# EAGLE design electricals_with_iPod_v2.5 (EAGLE 6.5.0)
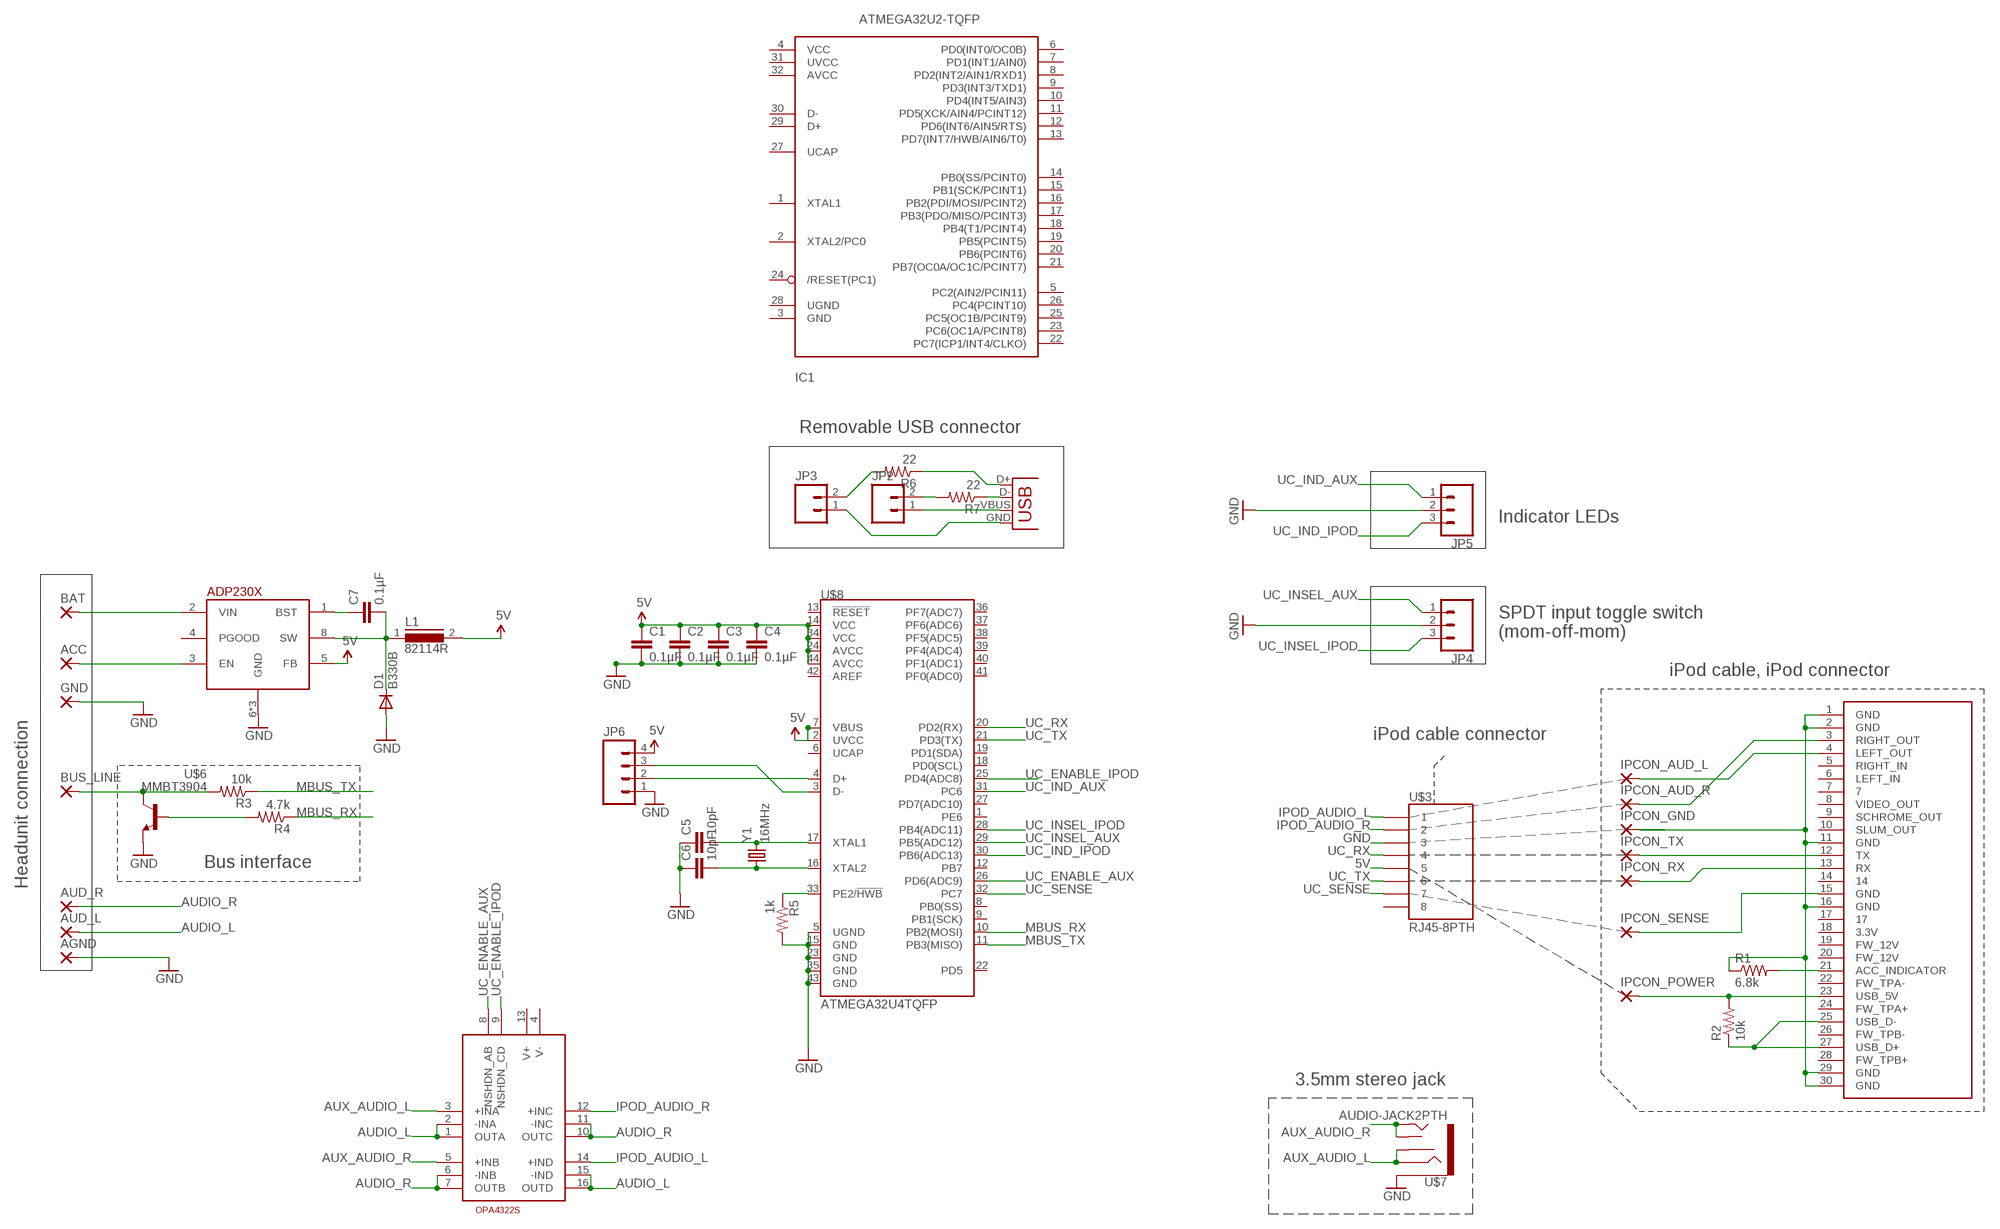
[diagram p0: schematic, sheet 1]

## Parts
ACC  1,6/0,9  [1,6/0,9]
AGND  1,6/0,9  [1,6/0,9]
AUD_L  1,6/0,9  [1,6/0,9]
AUD_R  1,6/0,9  [1,6/0,9]
BAT  2,54/1,1  [2,54/1,1]
BUS_LINE  1,6/0,9  [1,6/0,9]
C1  0.1µF  CAP0805  [0805]
C2  0.1µF  CAP0805  [0805]
C3  0.1µF  CAP0805  [0805]
C4  0.1µF  CAP0805  [0805]
C5  10pF  CAP0805  [0805]
C6  10pF  CAP0805  [0805]
C7  0.1µF  CAP0805  [0805]
D1  B330B  DIODESMA-ALT  [SMA-DIODE_ALT]
GND  2,54/1,1  [2,54/1,1]
IC1  ATMEGA32U2-TQFP  [TQFP32-08]
IPCON_AUD_L  1,6/0,9  [1,6/0,9]
IPCON_AUD_R  1,6/0,9  [1,6/0,9]
IPCON_GND  1,6/0,9  [1,6/0,9]
IPCON_POWER  1,6/0,9  [1,6/0,9]
IPCON_RX  1,6/0,9  [1,6/0,9]
IPCON_SENSE  1,6/0,9  [1,6/0,9]
IPCON_TX  1,6/0,9  [1,6/0,9]
JP1  USBSMD  [USB-MINIB]
JP2  M02POGO_PIN_HOLES_ONLY  [1X02_PP_HOLES_ONLY]
JP3  M02POGO_PIN_HOLES_ONLY  [1X02_PP_HOLES_ONLY]
JP4  M03LOCK  [1X03_LOCK]
JP5  M03LOCK  [1X03_LOCK]
JP6  M04PTH  [1X04]
L1  82114R  [82114R]
R1  6.8k  RESISTOR0805-RES  [0805]
R2  10k  RESISTOR0805-RES  [0805]
R3  10k  RESISTOR0805-RES  [0805]
R4  4.7k  RESISTOR0805-RES  [0805]
R5  1k  RESISTOR0805-RES  [0805]
R6  22  RESISTOR0805-RES  [0805]
R7  22  RESISTOR0805-RES  [0805]
U$1  IPOD_CONNECTOR_MALE  [IPOD_MALE_CONNECTOR]
U$3  RJ45-8PTH  [RJ45-8]
U$5  ADP230X  [SO8-THERM]
U$6  MMBT3904  [SOT23-3]
U$7  AUDIO-JACK2PTH  [AUDIO-JACK]
U$8  ATMEGA32U4TQFP  [SPARKFUN-DIGITALIC_TQFP44]
U$11  OPA4322S  [TSSOP16]
Y1  16MHz  CRYSTAL5X3  [CRYSTAL-SMD-5X3]

## Nets
5V: C1.1 C2.1 C3.1 C4.1 JP6.4 L1.2 U$3.5 U$5.5(FB) U$8.2(UVCC) U$8.7(VBUS) U$8.14(VCC) U$8.24(AVCC) U$8.34(VCC) U$8.44(AVCC)
AUDIO_L: AUD_L.1(P) U$11.1(OUTA) U$11.2(-INA) U$11.15(-IND) U$11.16(OUTD)
AUDIO_R: AUD_R.1(P) U$11.6(-INB) U$11.7(OUTB) U$11.10(OUTC) U$11.11(-INC)
AUX_AUDIO_L: U$7.RING U$7.RSH U$11.3(+INA)
AUX_AUDIO_R: U$7.TIP U$7.TSH U$11.5(+INB)
GND: AGND.1(P) C1.2 C2.2 C3.2 C4.2 C5.1 C6.1 D1.A GND.1(P) JP4.2 JP5.2 JP6.1 R5.2 U$3.3 U$5.6(GND) U$5.7(GND) U$5.PAD(GND) U$6.2(E) U$7.SLEEVE U$8.5(UGND) U$8.15(GND) U$8.23(GND) U$8.35(GND) U$8.43(GND)
IP_GND: IPCON_GND.1(P) R1.1 U$1.1(GND) U$1.2(GND) U$1.11(GND) U$1.16(GND) U$1.29(GND) U$1.30(GND)
IPOD_AUDIO_L: U$3.1 U$11.14(+IND)
IPOD_AUDIO_R: U$3.2 U$11.12(+INC)
MBUS_RX: R4.1 U$8.10(PB2(MOSI))
MBUS_TX: R3.1 U$8.11(PB3(MISO))
N$1: ACC.1(P) U$5.3(EN)
N$2: BAT.1(P) U$5.2(VIN)
N$3: C7.2 D1.C L1.1 U$5.8(SW)
N$4: IPCON_POWER.1(P) R2.2 U$1.23(USB_5V)
N$5: C7.1 U$5.1(BST)
N$6: IPCON_SENSE.1(P) U$1.15(GND)
N$7: IPCON_RX.1(P) U$1.13(RX)
N$8: IPCON_TX.1(P) U$1.12(TX)
N$9: IPCON_AUD_R.1(P) U$1.3(RIGHT_OUT)
N$10: IPCON_AUD_L.1(P) U$1.4(LEFT_OUT)
N$11: R2.1 U$1.25(USB_D-) U$1.27(USB_D+)
N$13: R1.2 U$1.21(ACC_INDICATOR)
N$14: R5.1 U$8.33(PE2/!HWB)
N$15: C5.2 U$8.17(XTAL1) Y1.3
N$19: BUS_LINE.1(P) R3.2 U$6.3(C)
N$20: R4.2 U$6.1(B)
N$21: JP1.D+ R6.1
N$22: JP1.D- R7.1
N$28: C6.2 U$8.16(XTAL2) Y1.1
UC_ENABLE_AUX: U$8.26(PD6(ADC9)) U$11.8(NSHDN_AB)
UC_ENABLE_IPOD: U$8.25(PD4(ADC8)) U$11.9(NSHDN_CD)
UC_IND_AUX: JP5.1 U$8.31(PC6)
UC_IND_IPOD: JP5.3 U$8.30(PB6(ADC13))
UC_INSEL_AUX: JP4.1 U$8.29(PB5(ADC12))
UC_INSEL_IPOD: JP4.3 U$8.28(PB4(ADC11))
UC_RX: U$3.4 U$8.20(PD2(RX))
UC_SENSE: U$3.7 U$8.32(PC7)
UC_TX: U$3.6 U$8.21(PD3(TX))
USB_BOB_D+: JP3.2 R6.2
USB_BOB_D-: JP2.2 R7.2
USB_BOB_GND: JP1.GND JP3.1
USB_BOB_VBUS: JP1.VBUS JP2.1
USB_D+: JP6.2 U$8.4(D+)
USB_D-: JP6.3 U$8.3(D-)
Unconnected: IC1.1(XTAL1) IC1.2(XTAL2/PC0) IC1.3(GND) IC1.4(VCC) IC1.5(PC2(AIN2/PCIN11)) IC1.6(PD0(INT0/OC0B)) IC1.7(PD1(INT1/AIN0)) IC1.8(PD2(INT2/AIN1/RXD1)) IC1.9(PD3(INT3/TXD1)) IC1.10(PD4(INT5/AIN3)) IC1.11(PD5(XCK/AIN4/PCINT12)) IC1.12(PD6(INT6/AIN5/RTS)) IC1.13(PD7(INT7/HWB/AIN6/T0)) IC1.14(PB0(SS/PCINT0)) IC1.15(PB1(SCK/PCINT1)) IC1.16(PB2(PDI/MOSI/PCINT2)) IC1.17(PB3(PDO/MISO/PCINT3)) IC1.18(PB4(T1/PCINT4)) IC1.19(PB5(PCINT5)) IC1.20(PB6(PCINT6)) IC1.21(PB7(OC0A/OC1C/PCINT7)) IC1.22(PC7(ICP1/INT4/CLKO)) IC1.23(PC6(OC1A/PCINT8)) IC1.24(/RESET(PC1)) IC1.25(PC5(OC1B/PCINT9)) IC1.26(PC4(PCINT10)) IC1.27(UCAP) IC1.28(UGND) IC1.29(D+) IC1.30(D-) IC1.31(UVCC) IC1.32(AVCC) U$1.5(RIGHT_IN) U$1.6(LEFT_IN) U$1.7 U$1.8(VIDEO_OUT) U$1.9(SCHROME_OUT) U$1.10(SLUM_OUT) U$1.14 U$1.17 U$1.18(3.3V) U$1.19(FW_12V) U$1.20(FW_12V) U$1.22(FW_TPA-) U$1.24(FW_TPA+) U$1.26(FW_TPB-) U$1.28(FW_TPB+) U$3.8 U$5.4(PGOOD) U$8.1(PE6) U$8.6(UCAP) U$8.8(PB0(SS)) U$8.9(PB1(SCK)) U$8.12(PB7) U$8.13(!RESET) U$8.18(PD0(SCL)) U$8.19(PD1(SDA)) U$8.22(PD5) U$8.27(PD7(ADC10)) U$8.36(PF7(ADC7)) U$8.37(PF6(ADC6)) U$8.38(PF5(ADC5)) U$8.39(PF4(ADC4)) U$8.40(PF1(ADC1)) U$8.41(PF0(ADC0)) U$8.42(AREF) U$11.4(V-) U$11.13(V+)

## Notes on the sheet
- Removable USB connector
- Indicator LEDs
- SPDT input toggle switch
  (mom-off-mom)
- iPod cable, iPod connector
- iPod cable connector
- Headunit connection
- Bus interface
- 3.5mm stereo jack

## Library data of the parts
ACC AGND AUD_L AUD_R BUS_LINE IPCON_AUD_L IPCON_AUD_R IPCON_GND IPCON_POWER IPCON_RX IPCON_SENSE IPCON_TX = wirepad:1,6/0,9: THROUGH-HOLE PAD
BAT GND = wirepad:2,54/1,1: THROUGH-HOLE PAD
C1-C7 = SparkFun-Passives:CAP: Capacitor Standard 0603 ceramic capacitor, and 0.1" leaded capacitor.
D1 = SparkFun:DIODE: Diode These are standard reverse protection diodes and small signal diodes. SMA package can handle up to about 1A. SOD-323 can handle about 200mA. What the SOD-323 package when ordering, there are some mfgs out there that are 5-pin packages.
IC1 = adafruit:ATMEGA32U2: ATmega32u2 Pin compatible with the atmega8u2, atmega16u2 and atmega32u2 8, 16 or 32 K flash, 1K RAM, 512b EEPROM 8 bit and 16 bit timer (5 PWM total) UART, SPI (no I2C!) USB with 4 endpoints, LUFA compatible 22 I/O lines, analog comparator (no ADC!) Comes with DFU bootloader burned in!
JP1 = SparkFun-Connectors:USB: USB Connectors USB-B-PTH is fully proven SKU : PRT-00139/CONN-08278 USB-miniB is fully proven SKU : PRT-00587 USB-A-PCB is untested. USB-A-H is throughly reviewed, but untested. Spark Fun Electronics SKU : PRT-00437 USB-B-SMT is throughly reviewed, but untested. Needs silkscreen touching up. USB-A-S has not been used/tested USB-MB-H has not been used/tested USB-MICROB has been used. CONN-09505
JP2 JP3 = SparkFun-Connectors:M02: Header 2 Standard 2-pin 0.1" header. Use with straight break away headers (SKU : PRT-00116), right angle break away headers (PRT-00553), swiss pins (PRT-00743), machine pins (PRT-00117), and female headers (PRT-00115). Molex polarized connector foot print use with SKU : PRT-08233 with associated crimp pins and housings.
JP4 JP5 = SparkFun-Connectors:M03: Header 3 Standard 3-pin 0.1" header. Use with straight break away headers (SKU : PRT-00116), right angle break away headers (PRT-00553), swiss pins (PRT-00743), machine pins (PRT-00117), and female headers (PRT-00115). Molex polarized connector foot print use with SKU : PRT-08232 with associated crimp pins and housings.
JP6 = SparkFun-Connectors:M04: Header 4 Standard 4-pin 0.1" header. Use with straight break away headers (SKU : PRT-00116), right angle break away headers (PRT-00553), swiss pins (PRT-00743), machine pins (PRT-00117), and female headers (PRT-00115). Molex polarized connector foot print use with SKU : PRT-08231 with associated crimp pins and housings. 1MM SMD Version SKU: PRT-10208
L1 = inductors:82114R: INDUCTOR
R1-R7 = SparkFun-Resistors:RESISTOR: Resistor Basic schematic elements and footprints for 0603, 1206, and PTH resistors.
U$1 = SparkFun:IPOD_CONNECTOR_MALE: iPod Male Connector This is the connector that will insert into an iPods. Use this connector to gain access to the various iPod pins. Schematic and footprint are not yet production proven. The PCB thickness must be more thin than the standard 0.062" FR4. Spark Fun Electronics SKU : DEV-00633
U$3 = SparkFun-Connectors:RJ45-8: RJ45 Jack Simple RJ45, 8-pin connection - connector for common Cat5, Cat5e, and Cat6 Ethernet cables. Footprint not yet proven in production. Connector sku is PRT-00643; Breakout PCB sku is BOB-00716.
U$5 = personal:ADP230X
U$6 = personal:MMBT3904
U$7 = SparkFun-Connectors:AUDIO-JACK2: Stereo audio jack with bypass switches.
U$8 = SparkFun-DigitalIC:ATMEGA32U4: Atmel 44-pin 8-bit Microcontroller with 32KBytes of ISP Flash and USB Controller
U$11 = personal:OPA4322S
Y1 = SparkFun-FreqCtrl:CRYSTAL: Various standard crystals. Proven footprints. Spark Fun Electronics SKU : COM-00534

## Board
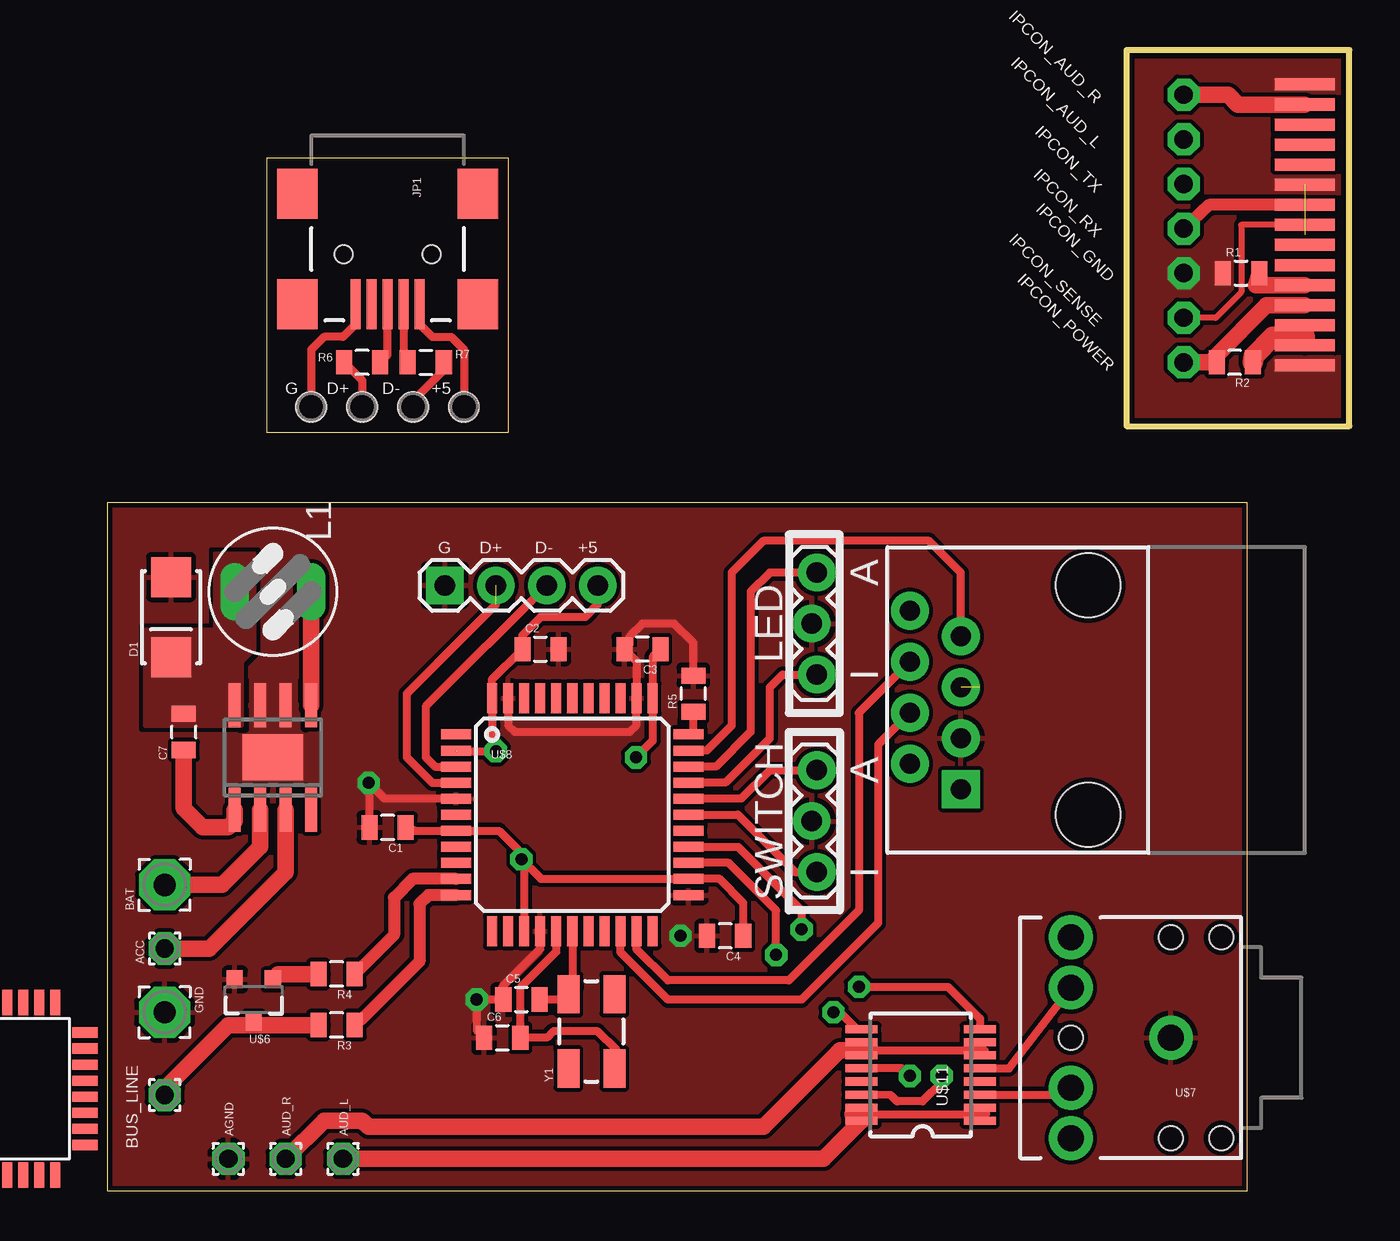
[diagram p1: board, top side]
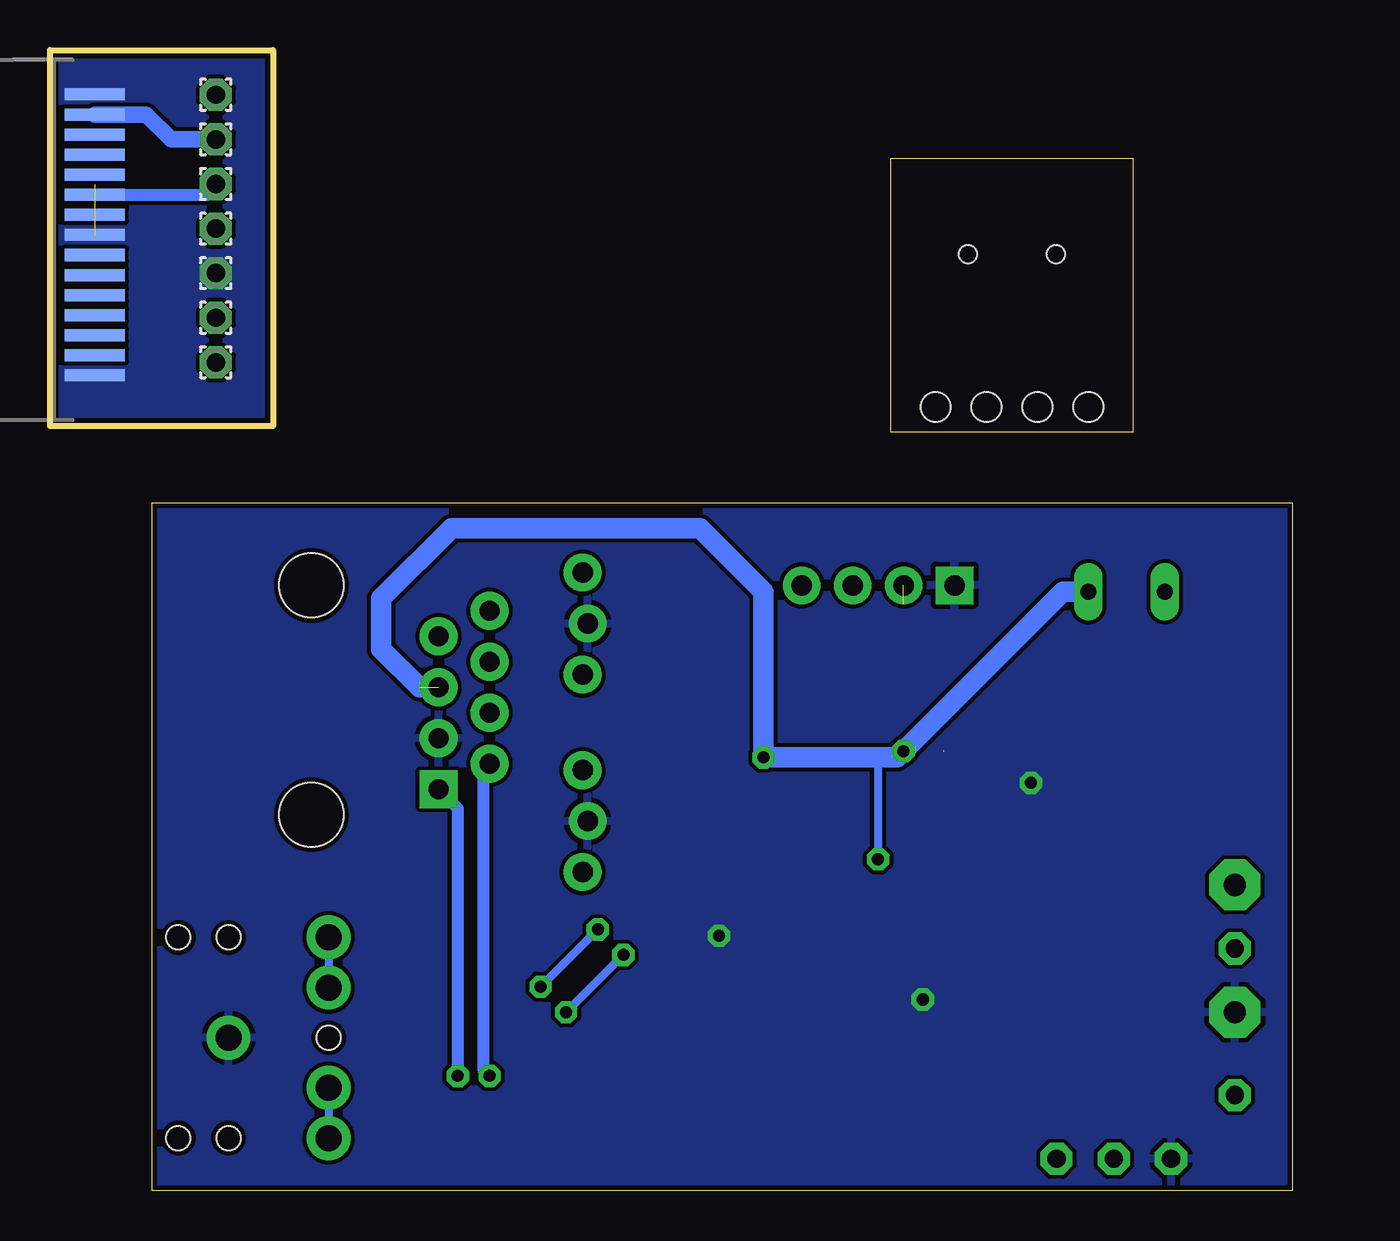
[diagram p2: board, bottom side, seen from below]

Size 61.91 x 56.83 mm. Coordinates in mm from the lower left corner, seen from the top.
Outline: 0,0 56.82,0 56.82,34.28 0,34.28 0,0
Outline: 61.91,56.83 50.8,56.83 50.8,38.1 61.91,38.1 61.91,56.83
Outline: 7.94,51.44 7.94,37.78 20,37.78 20,51.44 7.94,51.44
Copper layers (1*16): Top 0.035mm / dielectric 1.5mm / Bottom 0.035mm
Design rules "SparkFun": minimum track width 8mil, minimum drill 20mil, track to track 8mil, track to pad 8mil, pad to pad 8mil, via to via 8mil, smd to smd 8mil, copper to edge 10mil, drill to drill 8mil, minimum pad ring 12mil, minimum via ring 10mil, stop-mask expansion 4mil, vias tented up to drill 25mil, thermal gap 10mil

### Footprints (pad centres in the part's own frame; a part is rotated, then mirrored left to right if it is on the bottom)
1,6/0,9 = drill 0.914 pad 1.6 octagon: 1 0,0
2,54/1,1 = drill 1.118 pad 2.54 octagon: 1 0,0
0805 = smd 0.8 x 1.2: 1 -0.9,0; 2 0.9,0
SMA-DIODE_ALT = smd 2 x 2: A -2,0; C 2,0
TQFP32-08 = smd 1.27 x 0.508: 1 -4.293,2.8; 2 -4.293,2; 3 -4.293,1.2; 4 -4.293,0.4; 5 -4.293,-0.4; 6 -4.293,-1.2; 7 -4.293,-2; 8 -4.293,-2.8; 17 4.293,-2.8; 18 4.293,-2; 19 4.293,-1.2; 20 4.293,-0.4; 21 4.293,0.4; 22 4.293,1.2; 23 4.293,2; 24 4.293,2.8 | smd 0.508 x 1.27: 9 -2.8,-4.293; 10 -2,-4.293; 11 -1.2,-4.293; 12 -0.4,-4.293; 13 0.4,-4.293; 14 1.2,-4.293; 15 2,-4.293; 16 2.8,-4.293; 25 2.8,4.293; 26 2,4.293; 27 1.2,4.293; 28 0.4,4.293; 29 -0.4,4.293; 30 -1.2,4.293; 31 -2,4.293; 32 -2.8,4.293
USB-MINIB = smd 2.5 x 0.5: D+ 2.5,0; D- 2.5,0.8; GND 2.5,-1.6; ID 2.5,-0.8; VBUS 2.5,1.6 | smd 2.5 x 2: MTN1 -3,4.5; MTN2 2.5,4.5; MTN3 -3,-4.5; MTN4 2.5,-4.5 | hole 0.9: 0,2.2; 0,-2.2
1X02_PP_HOLES_ONLY = drill 0.889 pad 0.813: 1 0,0; 2 2.54,0 | hole 1.473: 0,0; 2.54,0
1X03_LOCK = drill 1.016 pad 1.88: 1 0,0.127; 2 2.54,-0.127; 3 5.08,0.127
1X04 = drill 1.016 pad 1.88 square: 1 0,0 | drill 1.016 pad 1.88: 2 2.54,0; 3 5.08,0; 4 7.62,0
82114R = drill 0.813 long: 1 0,1.905; 2 0,-1.905
IPOD_MALE_CONNECTOR = smd 0.6 x 3 bottom: 1 7.5,0; 3 6.5,0; 5 5.5,0; 7 4.5,0; 9 3.5,0; 11 2.5,0; 13 1.5,0; 15 0.5,0; 17 -0.5,0; 19 -1.5,0; 21 -2.5,0; 23 -3.5,0; 25 -4.5,0; 27 -5.5,0; 29 -6.5,0 | smd 0.6 x 3: 2 7,0; 4 6,0; 6 5,0; 8 4,0; 10 3,0; 12 2,0; 14 1,0; 16 0,0; 18 -1,0; 20 -2,0; 22 -3,0; 24 -4,0; 26 -5,0; 28 -6,0; 30 -7,0
RJ45-8 = drill 1 pad 1.88 square: 1 -4.445,6.35 | drill 1 pad 1.88: 2 -3.175,8.89; 3 -1.905,6.35; 4 -0.635,8.89; 5 0.635,6.35; 6 1.905,8.89; 7 3.175,6.35; 8 4.445,8.89 | hole 3.2: -5.715,0; 5.715,0
SO8-THERM = smd 0.6 x 2.2: 1 -1.905,-2.6; 2 -0.635,-2.6; 3 0.635,-2.6; 4 1.905,-2.6; 5 1.905,2.6; 6 0.635,2.6; 7 -0.635,2.6; 8 -1.905,2.6 | smd 3 x 2.3: PAD 0,0
SOT23-3 = smd 0.8 x 0.9: 1 -0.95,-1; 2 0.95,-1; 3 0,1.1
AUDIO-JACK = drill 1.3 pad 2.184: RING 5,5; RSH 5,2.5; SLEEVE 0,0; TIP 5,-5; TSH 5,-2.5 | hole 1.2: 0,5; -2.5,5; -2.5,-5; 0,-5; 5,0
SPARKFUN-DIGITALIC_TQFP44 = smd 1.5 x 0.5: 1 -5.8,4; 2 -5.8,3.2; 3 -5.8,2.4; 4 -5.8,1.6; 5 -5.8,0.8; 6 -5.8,0; 7 -5.8,-0.8; 8 -5.8,-1.6; 9 -5.8,-2.4; 10 -5.8,-3.2; 11 -5.8,-4; 23 5.8,-4; 24 5.8,-3.2; 25 5.8,-2.4; 26 5.8,-1.6; 27 5.8,-0.8; 28 5.8,0; 29 5.8,0.8; 30 5.8,1.6; 31 5.8,2.4; 32 5.8,3.2; 33 5.8,4 | smd 0.5 x 1.5: 12 -4,-5.8; 13 -3.2,-5.8; 14 -2.4,-5.8; 15 -1.6,-5.8; 16 -0.8,-5.8; 17 0,-5.8; 18 0.8,-5.8; 19 1.6,-5.8; 20 2.4,-5.8; 21 3.2,-5.8; 22 4,-5.8; 34 4,5.8; 35 3.2,5.8; 36 2.4,5.8; 37 1.6,5.8; 38 0.8,5.8; 39 0,5.8; 40 -0.8,5.8; 41 -1.6,5.8; 42 -2.4,5.8; 43 -3.2,5.8; 44 -4,5.8
TSSOP16 = smd 0.4 x 1.6: 1 -2.225,-2.85; 2 -1.575,-2.85; 3 -0.925,-2.85; 4 -0.275,-2.85; 5 0.375,-2.85; 6 1.025,-2.85; 7 1.675,-2.85; 8 2.325,-2.85; 9 2.325,3.05; 10 1.675,3.05; 11 1.025,3.05; 12 0.375,3.05; 13 -0.275,3.05; 14 -0.925,3.05; 15 -1.575,3.05; 16 -2.225,3.05
CRYSTAL-SMD-5X3 = smd 1.9 x 1.1: 1 -1.85,-1.15; 2 1.85,-1.15; 3 1.85,1.15; 4 -1.85,1.15

### Placement (x,y rotation side)
ACC  2.86,12.06 90 top
AGND  6.03,1.59 180 top
AUD_L  11.75,1.59 180 top
AUD_R  8.89,1.59 180 top
BAT  2.86,15.24 90 top
BUS_LINE  2.86,4.76 90 top
C1  13.97,18.1 180 top
C2  21.59,26.99 0 top
C3  26.67,26.99 180 top
C4  30.8,12.7 180 top
C5  20.64,9.53 0 top
C6  19.68,7.62 0 top
C7  3.81,22.86 90 top
D1  3.17,28.57 270 top
GND  2.86,8.89 270 top
IC1  -5.4,5.08 0 top
IPCON_AUD_L  53.66,52.39 0 bottom
IPCON_AUD_R  53.66,54.61 0 bottom
IPCON_GND  53.66,45.72 0 bottom
IPCON_POWER  53.66,41.27 0 bottom
IPCON_RX  53.66,47.94 0 bottom
IPCON_SENSE  53.66,43.5 0 bottom
IPCON_TX  53.66,50.16 0 bottom
JP1  13.97,46.67 270 top
JP2  17.78,39.05 180 top
JP3  10.16,39.05 0 top
JP4  35.24,20.95 270 top
JP5  35.24,30.8 270 top
JP6  16.83,30.16 0 top
L1  8.26,29.84 90 top
R1  56.52,45.72 0 top
R2  56.2,41.27 180 top
R3  11.43,8.26 180 top
R4  11.43,10.79 180 top
R5  29.21,24.77 90 top
R6  12.7,41.27 180 top
R7  15.88,41.27 0 top
U$1  59.69,47.62 90 bottom
U$3  48.9,24.45 90 top
U$5  8.26,21.59 0 top
U$6  7.3,9.53 180 top
U$7  53.02,7.62 180 top
U$8  23.18,18.73 0 top
U$11  40.64,5.71 90 top
Y1  24.13,7.94 90 top

### Tracks (layer width: path | path; a pad name or v marks a point on that pad's centre or on a via)
5V  (via drill 0.6)  (2 unrouted)
  Top 0.406: 17.38,21.91 v19.37,21.91 19.18,22.73 U$8.44 19.18,25.48 C2.1 20.69,27.68 21.59,28.57 23.81,28.57 24.45,29.21 JP6.4 | v26.35,21.59 27.18,22.41 U$8.34 27.18,26.59 C3.1 | v20.64,16.51 20.78,16.37 U$8.14 | v20.64,16.51 21.61,15.53 U$8.24 29,15.51 29.06,15.56 30.48,15.56 31.7,14.34 C4.1 | v20.64,16.51 20.64,16.82 19.52,17.93 U$8.7 15.34,17.93 C1.1
  Top 0.813: U$5.5 L1.2
  Bottom 0.406: v26.35,21.59 20.64,21.59 | 20.64,21.59 v20.64,16.51 | 20.64,21.59 19.68,21.59 v19.37,21.91
  Bottom 1.016: 43.5,25.08 45.4,26.99 45.4,29.53 41.91,33.02 29.53,33.02 26.35,29.84 v26.35,21.59 19.68,21.59 11.43,29.84 L1.2
AUDIO_L
  Top 0.305: U$11.16 37.46,3.49 | U$11.1 43.8,3.81 43.49,3.82 U$11.2 | 37.15,3.81 37.28,3.81 U$11.15
  Top 0.406: 37.28,3.81 43.8,3.81
  Top 0.813: AUD_L.1 35.69,1.59 U$11.16 | 37.46,3.49 37.15,3.81
AUDIO_R
  Top 0.305: 37.59,7.18 U$11.11 37.59,6.86 37.47,6.99 37.59,7.18 | U$11.6 U$11.7 43.72,6.99 | U$11.10 37.59,7.18
  Top 0.406: 37.47,6.99 43.72,6.99
  Top 0.813: 37.47,6.99 36.51,6.99 32.7,3.17 13.02,3.17 12.7,3.49 10.79,3.49 AUD_R.1
AUX_AUDIO_L
  Top 0.406: U$11.3 47.08,4.79 U$7.RSH
  Bottom 0.406: U$7.RSH U$7.RING
AUX_AUDIO_R
  Top 0.406: U$11.5 44.95,6.09 U$7.TSH
  Bottom 0.406: U$7.TIP U$7.TSH
GND  (via drill 0.6)
  Top 0.406: U$8.5 13.82,19.53 v13.02,20.32 13.07,20.05 C1.2 | U$8.15 21.58,12.05 19.68,10.16 19.67,9.33 C5.1 v18.41,9.53 18.41,7.99 C6.1 | R5.2 29.21,27.3 28.26,28.26 26.67,28.26 26.04,27.62 26.04,27.25 C3.2 26.38,26.38 U$8.35 26.38,23.2 26.04,22.86 20.32,22.86 19.98,23.2 U$8.43
  other vias: 28.57,12.7
  pour Bottom: 0,34.29 56.83,34.29 56.83,0 0,0
  pour Top (rank 2): 0,34.29 0,0 56.83,0 56.83,34.29
  pour Top (isolate 0.254, rank 2, no thermals): 5.08,18.73 11.75,18.73 11.75,27.3 5.08,27.3
IP_GND  (1 unrouted)
  pour Top (no thermals): 50.8,56.83 50.8,38.1 61.91,38.1 61.91,56.83
  pour Bottom (no thermals): 50.8,56.83 50.8,38.1 61.91,38.1 61.91,56.83
IPOD_AUDIO_L  (via drill 0.6)
  Top 0.406: v41.59,5.71 41.59,5.4 40.64,4.45 39.37,4.45 39.05,4.76 U$11.14
  Bottom 0.61: U$3.1 41.59,19.05 v41.59,5.71
IPOD_AUDIO_R  (via drill 0.6)
  Top 0.406: v40.01,5.71 39.63,6.09 U$11.12
  Bottom 0.61: U$3.2 40.01,20.95 40.32,20.64 40.32,6.03 v40.01,5.71
MBUS_RX
  Top 0.61: U$8.10 15.21,15.53 14.29,14.61 14.29,12.75 R4.1
MBUS_TX
  Top 0.61: U$8.11 16,14.73 15.56,14.29 15.56,11.43 12.7,8.57 R3.1
N$1
  Top 0.813: ACC.1 5.08,12.06 8.89,15.88 U$5.3
N$2
  Top 0.813: BAT.1 5.71,15.24 7.62,17.14 U$5.2
N$3
  pour Top (isolate 0.254, no thermals): 1.91,27.94 5.4,27.94 5.4,31.75 7.3,31.75 7.3,26.99 6.67,26.35 6.67,23.18 1.91,23.18
N$4
  Top 0.61: 55.24,41.41 R2.2
  Top 0.813: U$1.23 57.78,44.12 55.24,41.59 55.24,41.41 | IPCON_POWER.1 R2.2
N$5
  Top 0.813: U$5.1 6.35,18.41 6.03,18.1 4.76,18.1 3.81,19.05 C7.1
N$6
  Top 0.305: U$1.15 56.52,48.12 56.52,44.77 55.24,43.5 IPCON_SENSE.1
N$7
  Top 0.61: U$1.13 54.93,49.12 IPCON_RX.1
N$8
  Bottom 0.61: U$1.12 54.07,49.62 IPCON_TX.1
N$9
  Top 0.813: IPCON_AUD_R.1 55.88,54.61 56.35,54.12 U$1.3
N$10
  Bottom 0.813: U$1.4 57.12,53.62 55.88,52.39 IPCON_AUD_L.1
N$11
  Top 0.61: U$1.25 59.69,42.55 U$1.27
  Top 1.016: R2.1 57.15,41.59 58.1,42.55 59.69,42.55
N$13
  Top 0.813: U$1.21 57.24,45.12 R1.2
N$14
  Top 0.406: U$8.33 29.21,22.96 R5.1
N$15
  Top 0.406: U$8.17 23.18,10.16 | 23.18,10.16 23.18,9.53 C5.2 21.59,9.6 | Y1.3 23.35,10.16 23.18,10.16
N$19
  Top 0.813: BUS_LINE.1 2.86,5.08 6.03,8.26 7.3,8.26 | 7.3,8.26 U$6.3 | 7.3,8.26 R3.2
N$20
  Top 0.813: U$6.1 8.52,10.79 R4.2
N$21
  Top 0.406: R6.1 13.97,41.65 JP1.D+
N$22
  Top 0.406: JP1.D- 14.77,41.48 R7.1
N$28
  Top 0.406: U$8.16 22.38,11.9 20.59,10.11 C6.2 21.91,7.62 22.23,7.94 24.45,7.94 25.4,6.99 25.4,6.29 Y1.1
UC_ENABLE_AUX  (via drill 0.6)
  Top 0.406: U$8.26 31.45,17.13 34.61,13.97 v34.61,13.02 | v37.47,10.16 41.91,10.16 43.5,8.57 U$11.8
  Bottom 0.406: v34.61,13.02 v37.47,10.16
UC_ENABLE_IPOD  (via drill 0.6)
  Top 0.406: v33.34,11.75 33.34,13.97 30.98,16.33 U$8.25 | v36.2,8.89 36.51,8.89 37.36,8.04 U$11.9
  Bottom 0.406: v36.2,8.89 v33.34,11.75
UC_IND_AUX
  Top 0.406: U$8.31 30.34,21.13 32.07,22.86 32.07,29.84 33.02,30.8 JP5.1
UC_IND_IPOD
  Top 0.406: U$8.30 30.81,20.33 33.02,22.54 33.02,25.08 33.66,25.72 JP5.3
UC_INSEL_AUX
  Top 0.406: U$8.29 31.6,19.53 33.02,20.95 JP4.1
UC_INSEL_IPOD
  Top 0.406: U$8.28 31.43,18.73 34.29,15.88 JP4.3
UC_RX
  Top 0.406: U$3.4 38.42,22.23 38.42,13.34 34.61,9.53 27.94,9.53 25.58,11.89 U$8.20
UC_SENSE
  Top 0.406: U$3.7 42.55,30.8 40.96,32.38 32.7,32.38 31.11,30.8 31.11,23.18 29.87,21.93 U$8.32
UC_TX
  Top 0.406: U$3.6 37.47,23.81 37.47,13.97 33.97,10.48 27.94,10.48 26.38,12.04 U$8.21
USB_BOB_D+
  Top 0.406: R6.2 12.7,40.38 JP3.2
USB_BOB_D-
  Top 0.406: R7.2 16.83,41.22 16.83,40.96 15.24,39.37 JP2.2
USB_BOB_GND
  Top 0.406: JP1.GND 12.38,44.16 12.38,43.18 11.75,42.55 10.79,42.55 10.16,41.91 JP3.1
USB_BOB_VBUS
  Top 0.406: JP1.VBUS 15.56,44.16 15.56,43.18 16.19,42.55 17.14,42.55 17.78,41.91 JP2.1
USB_D+  (1 unrouted)
  Top 0.406: 19.37,29.21 14.92,24.77 14.92,21.59 16.19,20.32 17.36,20.32 U$8.4
USB_D-
  Top 0.406: U$8.3 16.33,21.13 15.88,21.59 15.88,24.13 JP6.3

### Text on the board
tPlace: A | LED | I | A | SWITCH | I
tNames: G | D+ | D- | +5 | G | D+ | D- | +5